# EAGLE design electricals_with_iPod_v2.6 (EAGLE 7.1.0)
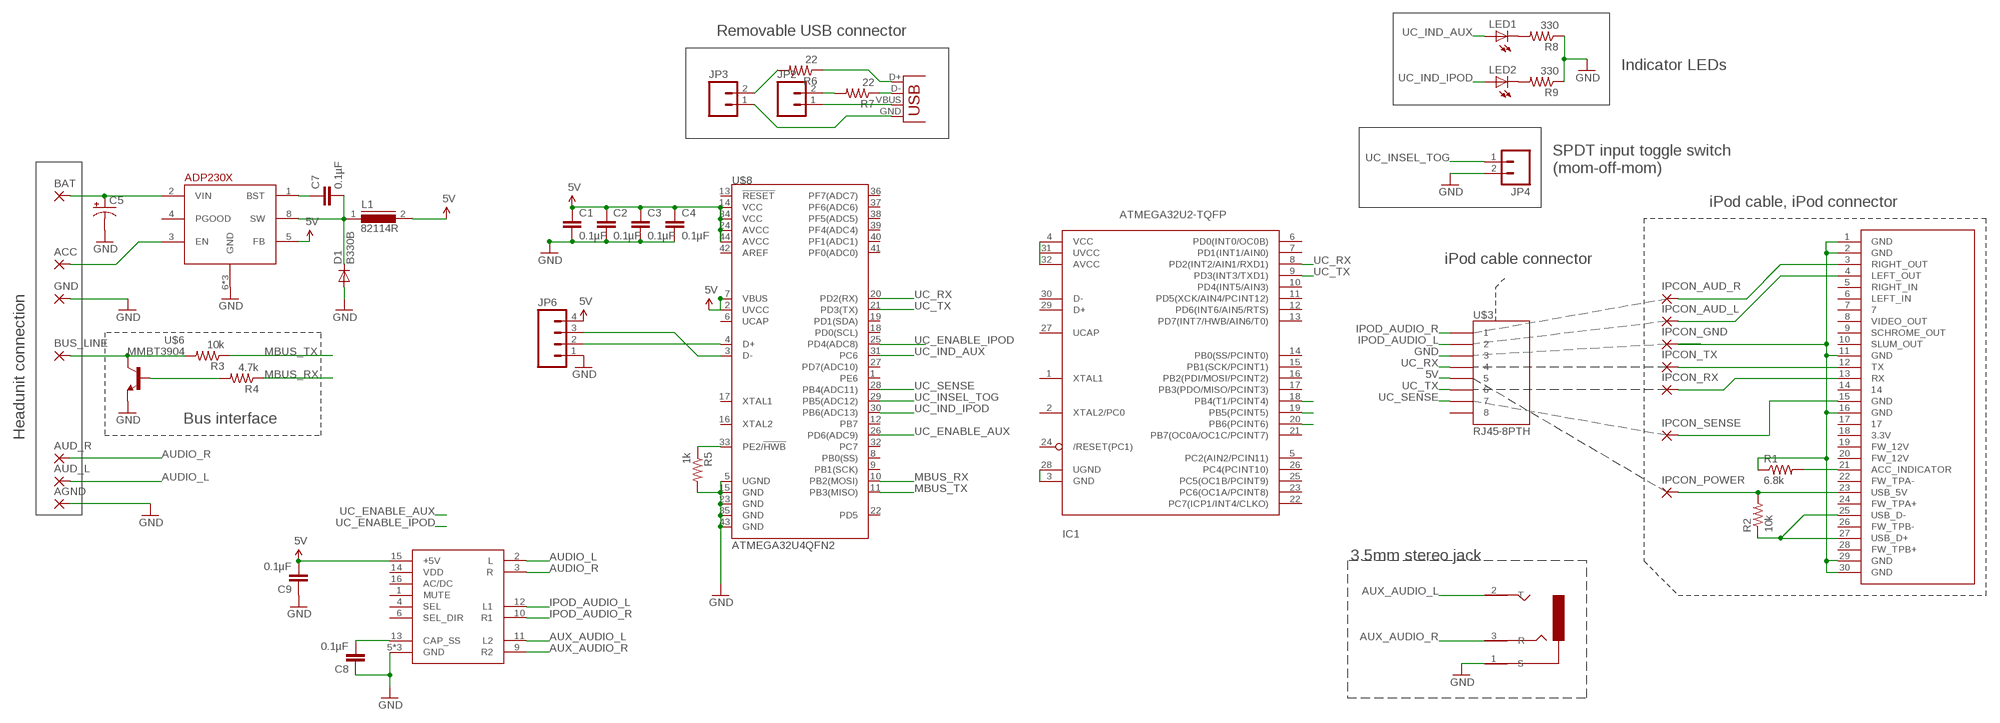
[diagram p0: schematic, sheet 1]

## Parts
ACC  1,6/0,9  [1,6/0,9]
AGND  1,6/0,9  [1,6/0,9]
AUD_L  1,6/0,9  [1,6/0,9]
AUD_R  1,6/0,9  [1,6/0,9]
BAT  2,54/1,1  [2,54/1,1]
BUS_LINE  1,6/0,9  [1,6/0,9]
C1  0.1µF  CAP0603-CAP  [0603-CAP]
C2  0.1µF  CAP0603-CAP  [0603-CAP]
C3  0.1µF  CAP0603-CAP  [0603-CAP]
C4  0.1µF  CAP0603-CAP  [0603-CAP]
C5  CAP_POLPTH2  [CPOL-RADIAL-10UF-25V]
C7  0.1µF  CAP0603-CAP  [0603-CAP]
C8  0.1µF  CAP0603-CAP  [0603-CAP]
C9  0.1µF  CAP0603-CAP  [0603-CAP]
D1  B330B  DIODESMA-ALT  [SMA-DIODE_ALT]
GND  2,54/1,1  [2,54/1,1]
IC1  ATMEGA32U2-TQFP  [TQFP32-08]
IPCON_AUD_L  1,6/0,9  [1,6/0,9]
IPCON_AUD_R  1,6/0,9  [1,6/0,9]
IPCON_GND  1,6/0,9  [1,6/0,9]
IPCON_POWER  1,6/0,9  [1,6/0,9]
IPCON_RX  1,6/0,9  [1,6/0,9]
IPCON_SENSE  1,6/0,9  [1,6/0,9]
IPCON_TX  1,6/0,9  [1,6/0,9]
JP1  USBSMD  [USB-MINIB]
JP2  M02POGO_PIN_HOLES_ONLY  [1X02_PP_HOLES_ONLY]
JP3  M02POGO_PIN_HOLES_ONLY  [1X02_PP_HOLES_ONLY]
JP4  M02LOCK  [1X02_LOCK]
JP6  M04PTH  [1X04]
L1  82114R  [82114R]
LED1  LED0603  [LED-0603]
LED2  LED0603  [LED-0603]
R1  6.8k  RESISTOR0603-RES  [0603-RES]
R2  10k  RESISTOR0603-RES  [0603-RES]
R3  10k  RESISTOR0603-RES  [0603-RES]
R4  4.7k  RESISTOR0603-RES  [0603-RES]
R5  1k  RESISTOR0603-RES  [0603-RES]
R6  22  RESISTOR0603-RES  [0603-RES]
R7  22  RESISTOR0603-RES  [0603-RES]
R8  330  RESISTOR0603-RES  [0603-RES]
R9  330  RESISTOR0603-RES  [0603-RES]
U$1  IPOD_CONNECTOR_MALE  [IPOD_MALE_CONNECTOR]
U$3  RJ45-8PTH  [RJ45-8]
U$5  ADP230X  [SO8-THERM]
U$6  MMBT3904  [SOT23-3]
U$7  STEREO_JACK_SJ1-353XNG3NG  [3.5MM_SJ1-353XNG]
U$8  ATMEGA32U4QFN2  [SPARKFUN-DIGITALIC_QFN-44-NOPAD]
U$11  ISL54405IRTZ  [QFN-16]

## Nets
5V: C1.1 C2.1 C3.1 C4.1 C9.2 JP6.4 L1.2 U$3.5 U$5.5(FB) U$8.2(UVCC) U$8.7(VBUS) U$8.14(VCC) U$8.24(AVCC) U$8.34(VCC) U$8.44(AVCC) U$11.15(+5V)
AUDIO_L: AUD_L.1(P) U$11.2(L)
AUDIO_R: AUD_R.1(P) U$11.3(R)
AUX_AUDIO_L: U$7.2(T) U$11.11(L2)
AUX_AUDIO_R: U$7.3(R) U$11.9(R2)
GND: AGND.1(P) C1.2 C2.2 C3.2 C4.2 C5.2(-) C8.1 C9.1 D1.A GND.1(P) JP4.2 JP6.1 R5.2 R8.1 R9.1 U$3.3 U$5.6(GND) U$5.7(GND) U$5.PAD(GND) U$6.2(E) U$7.1(S) U$8.5(UGND) U$8.15(GND) U$8.23(GND) U$8.35(GND) U$8.43(GND) U$11.5(GND) U$11.7(GND) U$11.8(GND)
IP_GND: IPCON_GND.1(P) R1.1 U$1.1(GND) U$1.2(GND) U$1.11(GND) U$1.16(GND) U$1.29(GND) U$1.30(GND)
IPOD_AUDIO_L: U$3.2 U$11.12(L1)
IPOD_AUDIO_R: U$3.1 U$11.10(R1)
MBUS_RX: R4.1 U$8.10(PB2(MOSI))
MBUS_TX: R3.1 U$8.11(PB3(MISO))
N$1: ACC.1(P) U$5.3(EN)
N$2: BAT.1(P) C5.1(+) U$5.2(VIN)
N$3: C7.2 D1.C L1.1 U$5.8(SW)
N$4: IPCON_POWER.1(P) R2.2 U$1.23(USB_5V)
N$5: C7.1 U$5.1(BST)
N$6: IPCON_SENSE.1(P) U$1.15(GND)
N$7: IPCON_RX.1(P) U$1.13(RX)
N$8: IPCON_TX.1(P) U$1.12(TX)
N$9: IPCON_AUD_R.1(P) U$1.3(RIGHT_OUT)
N$10: IPCON_AUD_L.1(P) U$1.4(LEFT_OUT)
N$11: R2.1 U$1.25(USB_D-) U$1.27(USB_D+)
N$12: C8.2 U$11.13(CAP_SS)
N$13: R1.2 U$1.21(ACC_INDICATOR)
N$14: R5.1 U$8.33(PE2/!HWB)
N$15: LED1.C R8.2
N$16: LED2.C R9.2
N$17: IC1.3(GND) IC1.28(UGND)
N$18: IC1.4(VCC) IC1.32(AVCC)
N$19: BUS_LINE.1(P) R3.2 U$6.3(C)
N$20: R4.2 U$6.1(B)
N$21: JP1.D+ R6.1
N$22: JP1.D- R7.1
N$23: IC1.18(PB4(T1/PCINT4))
N$24: IC1.19(PB5(PCINT5))
N$25: IC1.20(PB6(PCINT6))
UC_ENABLE_AUX: U$8.26(PD6(ADC9))
UC_ENABLE_IPOD: U$8.25(PD4(ADC8))
UC_IND_AUX: LED1.A U$8.31(PC6)
UC_IND_IPOD: LED2.A U$8.30(PB6(ADC13))
UC_INSEL_TOG: JP4.1 U$8.29(PB5(ADC12))
UC_RX: IC1.8(PD2(INT2/AIN1/RXD1)) U$3.4 U$8.20(PD2(RX))
UC_SENSE: U$3.7 U$8.28(PB4(ADC11))
UC_TX: IC1.9(PD3(INT3/TXD1)) U$3.6 U$8.21(PD3(TX))
USB_BOB_D+: JP3.2 R6.2
USB_BOB_D-: JP2.2 R7.2
USB_BOB_GND: JP1.GND JP3.1
USB_BOB_VBUS: JP1.VBUS JP2.1
USB_D+: JP6.2 U$8.4(D+)
USB_D-: JP6.3 U$8.3(D-)
Unconnected: IC1.1(XTAL1) IC1.2(XTAL2/PC0) IC1.5(PC2(AIN2/PCIN11)) IC1.6(PD0(INT0/OC0B)) IC1.7(PD1(INT1/AIN0)) IC1.10(PD4(INT5/AIN3)) IC1.11(PD5(XCK/AIN4/PCINT12)) IC1.12(PD6(INT6/AIN5/RTS)) IC1.13(PD7(INT7/HWB/AIN6/T0)) IC1.14(PB0(SS/PCINT0)) IC1.15(PB1(SCK/PCINT1)) IC1.16(PB2(PDI/MOSI/PCINT2)) IC1.17(PB3(PDO/MISO/PCINT3)) IC1.21(PB7(OC0A/OC1C/PCINT7)) IC1.22(PC7(ICP1/INT4/CLKO)) IC1.23(PC6(OC1A/PCINT8)) IC1.24(/RESET(PC1)) IC1.25(PC5(OC1B/PCINT9)) IC1.26(PC4(PCINT10)) IC1.27(UCAP) IC1.29(D+) IC1.30(D-) IC1.31(UVCC) U$1.5(RIGHT_IN) U$1.6(LEFT_IN) U$1.7 U$1.8(VIDEO_OUT) U$1.9(SCHROME_OUT) U$1.10(SLUM_OUT) U$1.14 U$1.17 U$1.18(3.3V) U$1.19(FW_12V) U$1.20(FW_12V) U$1.22(FW_TPA-) U$1.24(FW_TPA+) U$1.26(FW_TPB-) U$1.28(FW_TPB+) U$3.8 U$5.4(PGOOD) U$8.1(PE6) U$8.6(UCAP) U$8.8(PB0(SS)) U$8.9(PB1(SCK)) U$8.12(PB7) U$8.13(!RESET) U$8.16(XTAL2) U$8.17(XTAL1) U$8.18(PD0(SCL)) U$8.19(PD1(SDA)) U$8.22(PD5) U$8.27(PD7(ADC10)) U$8.32(PC7) U$8.36(PF7(ADC7)) U$8.37(PF6(ADC6)) U$8.38(PF5(ADC5)) U$8.39(PF4(ADC4)) U$8.40(PF1(ADC1)) U$8.41(PF0(ADC0)) U$8.42(AREF) U$11.1(MUTE) U$11.4(SEL) U$11.6(SEL_DIR) U$11.14(VDD) U$11.16(AC/DC)

## Notes on the sheet
- Removable USB connector
- Indicator LEDs
- SPDT input toggle switch
  (mom-off-mom)
- iPod cable, iPod connector
- iPod cable connector
- Headunit connection
- Bus interface
- 3.5mm stereo jack

## Library data of the parts
ACC AGND AUD_L AUD_R BUS_LINE IPCON_AUD_L IPCON_AUD_R IPCON_GND IPCON_POWER IPCON_RX IPCON_SENSE IPCON_TX = wirepad:1,6/0,9: THROUGH-HOLE PAD
BAT GND = wirepad:2,54/1,1: THROUGH-HOLE PAD
C1-C4 C7-C9 = SparkFun-Passives:CAP: Capacitor Standard 0603 ceramic capacitor, and 0.1" leaded capacitor.
C5 = SparkFun-Capacitors:CAP_POL: Capacitor Polarized These are standard SMD and PTH capacitors. Normally 10uF, 47uF, and 100uF in electrolytic and tantalum varieties. Always verify the external diameter of the through hole cap, it varies with capacity, voltage, and manufacturer. The EIA devices should be standard.
D1 = SparkFun:DIODE: Diode These are standard reverse protection diodes and small signal diodes. SMA package can handle up to about 1A. SOD-323 can handle about 200mA. What the SOD-323 package when ordering, there are some mfgs out there that are 5-pin packages.
IC1 = adafruit:ATMEGA32U2: ATmega32u2 Pin compatible with the atmega8u2, atmega16u2 and atmega32u2 8, 16 or 32 K flash, 1K RAM, 512b EEPROM 8 bit and 16 bit timer (5 PWM total) UART, SPI (no I2C!) USB with 4 endpoints, LUFA compatible 22 I/O lines, analog comparator (no ADC!) Comes with DFU bootloader burned in!
JP1 = SparkFun-Connectors:USB: USB Connectors USB-B-PTH is fully proven SKU : PRT-00139/CONN-08278 USB-miniB is fully proven SKU : PRT-00587 USB-A-PCB is untested. USB-A-H is throughly reviewed, but untested. Spark Fun Electronics SKU : PRT-00437 USB-B-SMT is throughly reviewed, but untested. Needs silkscreen touching up. USB-A-S has not been used/tested USB-MB-H has not been used/tested USB-MICROB has been used. CONN-09505
JP2-JP4 = SparkFun-Connectors:M02: Header 2 Standard 2-pin 0.1" header. Use with straight break away headers (SKU : PRT-00116), right angle break away headers (PRT-00553), swiss pins (PRT-00743), machine pins (PRT-00117), and female headers (PRT-00115). Molex polarized connector foot print use with SKU : PRT-08233 with associated crimp pins and housings.
JP6 = SparkFun-Connectors:M04: Header 4 Standard 4-pin 0.1" header. Use with straight break away headers (SKU : PRT-00116), right angle break away headers (PRT-00553), swiss pins (PRT-00743), machine pins (PRT-00117), and female headers (PRT-00115). Molex polarized connector foot print use with SKU : PRT-08231 with associated crimp pins and housings. 1MM SMD Version SKU: PRT-10208
L1 = inductors:82114R: INDUCTOR
LED1 LED2 = SparkFun-LED:LED: LEDs Standard schematic elements and footprints for 5mm, 3mm, 1206, and 0603 sized LEDs. 5mm - Spark Fun Electronics SKU : COM-00529 (and others)
R1-R9 = SparkFun-Resistors:RESISTOR: Resistor Basic schematic elements and footprints for 0603, 1206, and PTH resistors.
U$1 = SparkFun:IPOD_CONNECTOR_MALE: iPod Male Connector This is the connector that will insert into an iPods. Use this connector to gain access to the various iPod pins. Schematic and footprint are not yet production proven. The PCB thickness must be more thin than the standard 0.062" FR4. Spark Fun Electronics SKU : DEV-00633
U$3 = SparkFun-Connectors:RJ45-8: RJ45 Jack Simple RJ45, 8-pin connection - connector for common Cat5, Cat5e, and Cat6 Ethernet cables. Footprint not yet proven in production. Connector sku is PRT-00643; Breakout PCB sku is BOB-00716.
U$5 = personal:ADP230X
U$6 = personal:MMBT3904
U$7 = personal:STEREO_JACK
U$8 = SparkFun-DigitalIC:ATMEGA32U4: Atmel 44-pin 8-bit Microcontroller with 32KBytes of ISP Flash and USB Controller
U$11 = personal:ISL54405

## Board
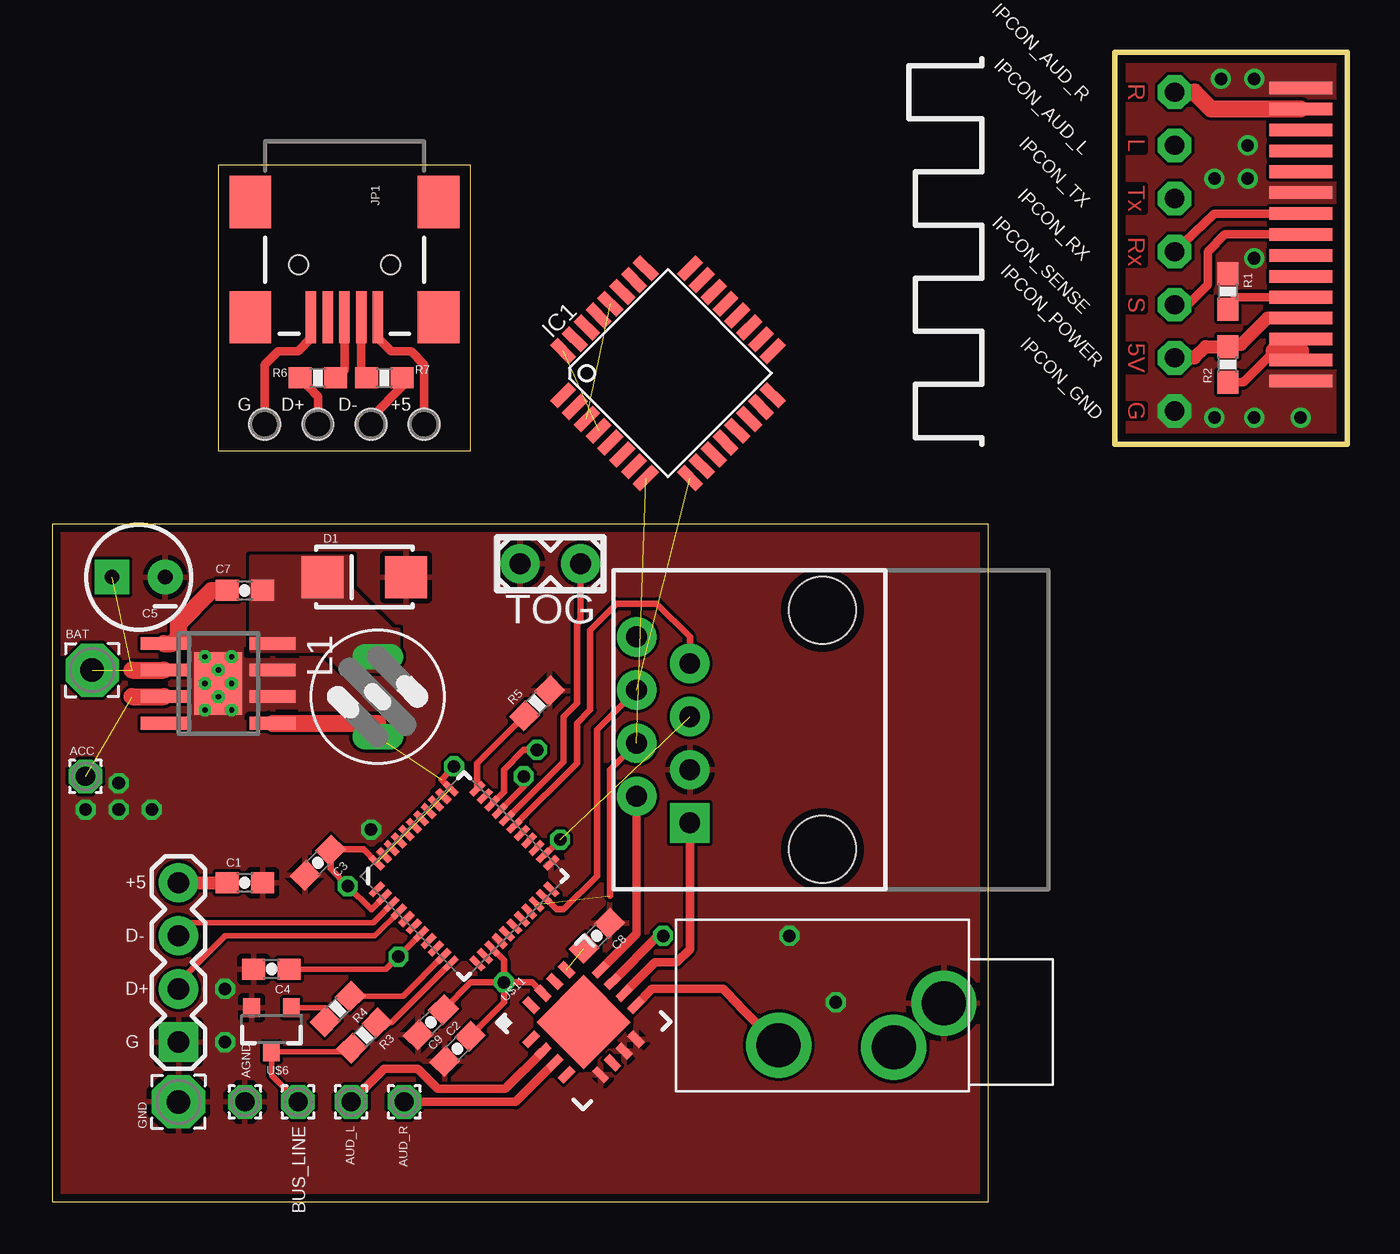
[diagram p1: board, top side]
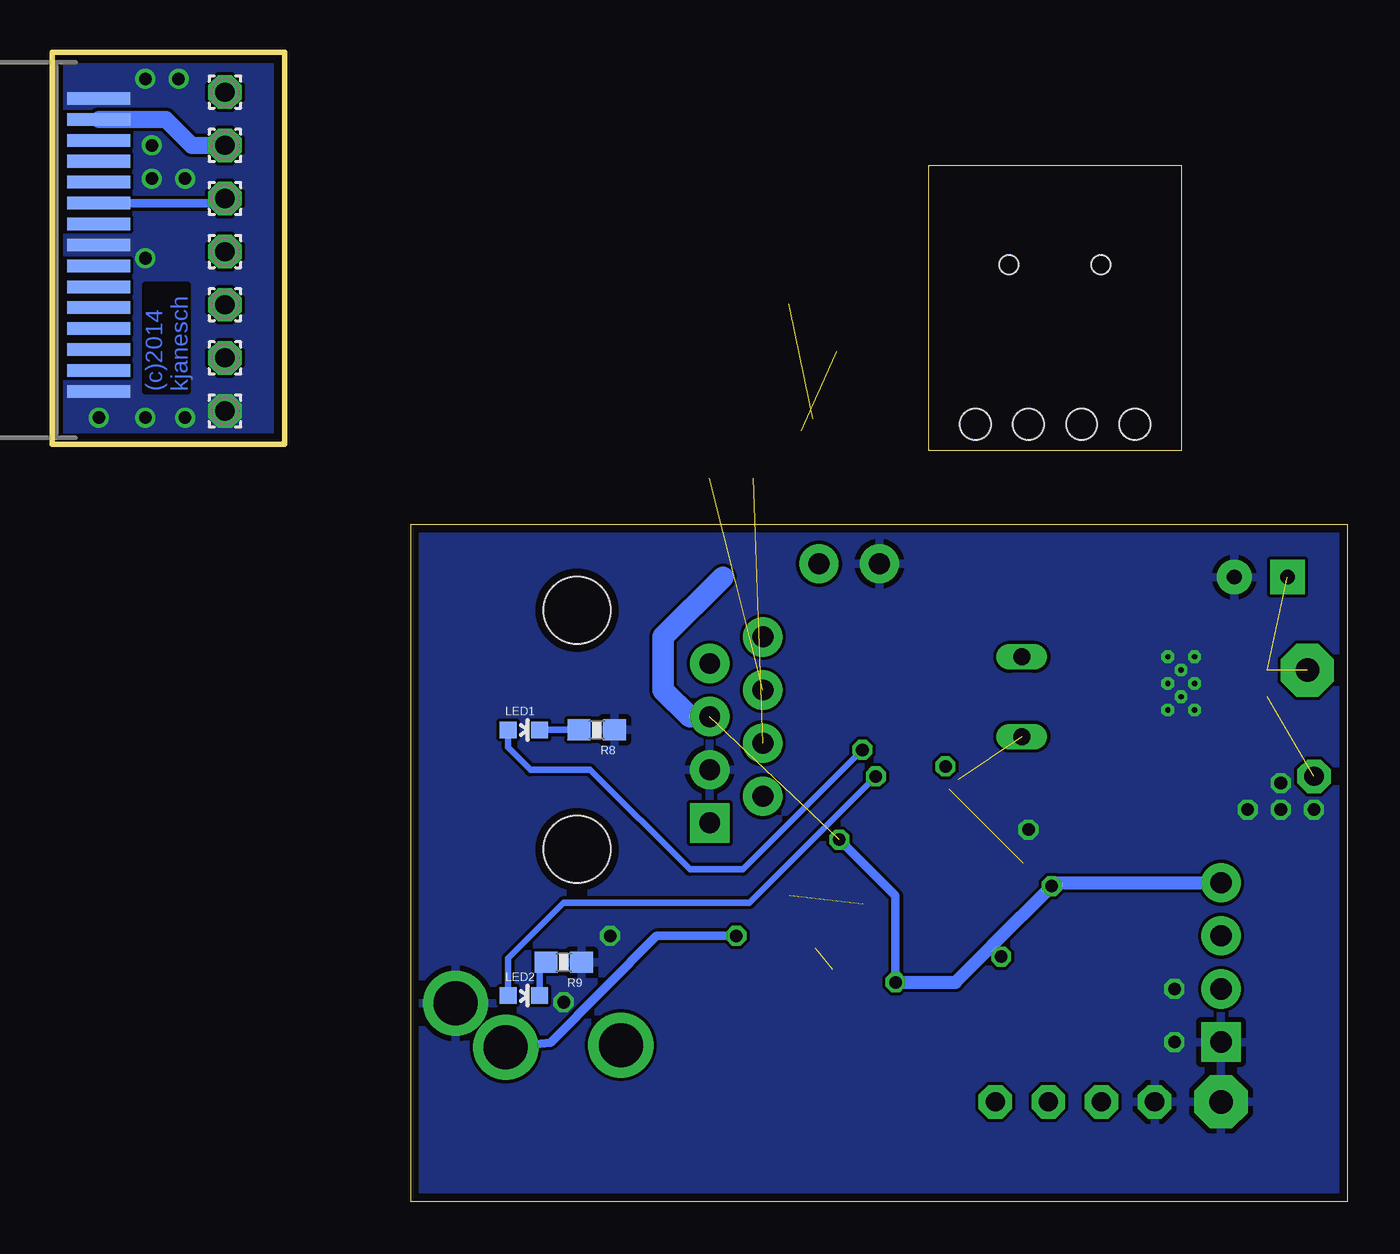
[diagram p2: board, bottom side, seen from below]

Size 61.91 x 54.93 mm. Coordinates in mm from the lower left corner, seen from the top.
Outline: 0,0 44.76,0 44.76,32.38 0,32.38 0,0
Outline: 61.91,54.93 50.8,54.93 50.8,36.2 61.91,36.2 61.91,54.93
Outline: 7.94,49.53 7.94,35.88 20,35.88 20,49.53 7.94,49.53
Copper layers (1*16): Top 0.0356mm / dielectric 1.5011mm / Bottom 0.0356mm
Design rules "LaenPCBOrder": minimum track width 6mil, minimum drill 13mil, track to track 6mil, track to pad 6mil, pad to pad 6mil, via to via 6mil, smd to smd 6mil, copper to edge 15mil, drill to drill 6mil, minimum pad ring 7mil, minimum via ring 7mil, stop-mask expansion 3mil, vias tented up to drill 0mil, thermal gap 10mil

### Footprints (pad centres in the part's own frame; a part is rotated, then mirrored left to right if it is on the bottom)
1,6/0,9 = drill 0.914 pad 1.6 octagon: 1 0,0
2,54/1,1 = drill 1.118 pad 2.54 octagon: 1 0,0
0603-CAP = smd 1.1 x 1: 1 -0.85,0; 2 0.85,0
CPOL-RADIAL-10UF-25V = drill 0.7 pad 1.651 square: 1 1.27,0 | drill 0.7 pad 1.651: 2 -1.27,0
SMA-DIODE_ALT = smd 2 x 2: A -2,0; C 2,0
TQFP32-08 = smd 1.27 x 0.508: 1 -4.293,2.8; 2 -4.293,2; 3 -4.293,1.2; 4 -4.293,0.4; 5 -4.293,-0.4; 6 -4.293,-1.2; 7 -4.293,-2; 8 -4.293,-2.8; 17 4.293,-2.8; 18 4.293,-2; 19 4.293,-1.2; 20 4.293,-0.4; 21 4.293,0.4; 22 4.293,1.2; 23 4.293,2; 24 4.293,2.8 | smd 0.508 x 1.27: 9 -2.8,-4.293; 10 -2,-4.293; 11 -1.2,-4.293; 12 -0.4,-4.293; 13 0.4,-4.293; 14 1.2,-4.293; 15 2,-4.293; 16 2.8,-4.293; 25 2.8,4.293; 26 2,4.293; 27 1.2,4.293; 28 0.4,4.293; 29 -0.4,4.293; 30 -1.2,4.293; 31 -2,4.293; 32 -2.8,4.293
USB-MINIB = smd 2.5 x 0.5: D+ 2.5,0; D- 2.5,0.8; GND 2.5,-1.6; ID 2.5,-0.8; VBUS 2.5,1.6 | smd 2.5 x 2: MTN1 -3,4.5; MTN2 2.5,4.5; MTN3 -3,-4.5; MTN4 2.5,-4.5 | hole 0.9: 0,2.2; 0,-2.2
1X02_PP_HOLES_ONLY = drill 0.889 pad 0.813: 1 0,0; 2 2.54,0 | hole 1.473: 0,0; 2.54,0
1X02_LOCK = drill 1.016 pad 1.88: 1 -0.178,0; 2 2.718,0
1X04 = drill 1.016 pad 1.88 square: 1 0,0 | drill 1.016 pad 1.88: 2 2.54,0; 3 5.08,0; 4 7.62,0
82114R = drill 0.813 long: 1 0,1.905; 2 0,-1.905
LED-0603 = smd 0.8 x 0.8: A 0,-0.75; C 0,0.75
0603-RES = smd 1.1 x 1: 1 -0.85,0; 2 0.85,0
IPOD_MALE_CONNECTOR = smd 0.6 x 3 bottom: 1 7.5,0; 3 6.5,0; 5 5.5,0; 7 4.5,0; 9 3.5,0; 11 2.5,0; 13 1.5,0; 15 0.5,0; 17 -0.5,0; 19 -1.5,0; 21 -2.5,0; 23 -3.5,0; 25 -4.5,0; 27 -5.5,0; 29 -6.5,0 | smd 0.6 x 3: 2 7,0; 4 6,0; 6 5,0; 8 4,0; 10 3,0; 12 2,0; 14 1,0; 16 0,0; 18 -1,0; 20 -2,0; 22 -3,0; 24 -4,0; 26 -5,0; 28 -6,0; 30 -7,0
RJ45-8 = drill 1 pad 1.88 square: 1 -4.445,6.35 | drill 1 pad 1.88: 2 -3.175,8.89; 3 -1.905,6.35; 4 -0.635,8.89; 5 0.635,6.35; 6 1.905,8.89; 7 3.175,6.35; 8 4.445,8.89 | hole 3.2: -5.715,0; 5.715,0
SO8-THERM = smd 0.6 x 2.2: 1 -1.905,-2.6; 2 -0.635,-2.6; 3 0.635,-2.6; 4 1.905,-2.6; 5 1.905,2.6; 6 0.635,2.6; 7 -0.635,2.6; 8 -1.905,2.6 | smd 3 x 2.3: PAD 0,0
SOT23-3 = smd 0.8 x 0.9: 1 -0.95,-1; 2 0.95,-1; 3 0,1.1
3.5MM_SJ1-353XNG = drill 2.1 pad 2.54: 1 -5.8,-0.9; 2 -3.4,1.2; 3 2.1,1.1
SPARKFUN-DIGITALIC_QFN-44-NOPAD = smd 0.8 x 0.3: 1 -3.4,2.5; 2 -3.4,2; 3 -3.4,1.5; 4 -3.4,1; 5 -3.4,0.5; 6 -3.4,0; 7 -3.4,-0.5; 8 -3.4,-1; 9 -3.4,-1.5; 10 -3.4,-2; 11 -3.4,-2.5; 23 3.4,-2.5; 24 3.4,-2; 25 3.4,-1.5; 26 3.4,-1; 27 3.4,-0.5; 28 3.4,0; 29 3.4,0.5; 30 3.4,1; 31 3.4,1.5; 32 3.4,2; 33 3.4,2.5 | smd 0.3 x 0.8: 12 -2.5,-3.4; 13 -2,-3.4; 14 -1.5,-3.4; 15 -1,-3.4; 16 -0.5,-3.4; 17 0,-3.4; 18 0.5,-3.4; 19 1,-3.4; 20 1.5,-3.4; 21 2,-3.4; 22 2.5,-3.4; 34 2.5,3.4; 35 2,3.4; 36 1.5,3.4; 37 1,3.4; 38 0.5,3.4; 39 0,3.4; 40 -0.5,3.4; 41 -1,3.4; 42 -1.5,3.4; 43 -2,3.4; 44 -2.5,3.4
QFN-16 = smd 0.8 x 0.4: 1 -2.35,1.2; 2 -2.35,0.4; 3 -2.35,-0.4; 4 -2.35,-1.2; 9 2.35,-1.2; 10 2.35,-0.4; 11 2.35,0.4; 12 2.35,1.2 | smd 0.35 x 0.8: 5 -1.2,-2.35 | smd 0.4 x 0.8: 6 -0.4,-2.35; 7 0.4,-2.35; 8 1.2,-2.35; 13 1.2,2.35; 14 0.4,2.35; 15 -0.4,2.35; 16 -1.2,2.35 | smd 3.19 x 3.19: EXP 0,0

### Placement (x,y rotation side)
ACC  1.59,20.32 0 top
AGND  9.21,4.76 180 top
AUD_L  14.29,4.76 0 top
AUD_R  16.83,4.76 0 top
BAT  1.91,25.4 0 top
BUS_LINE  11.75,4.76 90 top
C1  9.21,15.24 0 top
C2  18.1,8.57 225 top
C3  12.7,16.19 225 top
C4  10.48,11.11 180 top
C5  4.13,29.84 180 top
C7  9.21,29.21 0 top
C8  26.04,12.7 225 top
C9  19.37,7.3 45 top
D1  14.92,29.84 180 top
GND  6.03,4.76 90 top
IC1  29.43,39.59 45 top
IPCON_AUD_L  53.66,50.48 0 bottom
IPCON_AUD_R  53.66,53.02 0 bottom
IPCON_GND  53.66,37.78 0 bottom
IPCON_POWER  53.66,40.32 0 bottom
IPCON_RX  53.66,45.4 0 bottom
IPCON_SENSE  53.66,42.86 0 bottom
IPCON_TX  53.66,47.94 0 bottom
JP1  13.97,44.77 270 top
JP2  17.78,37.15 180 top
JP3  10.16,37.15 0 top
JP4  25.08,30.48 180 top
JP6  6.03,7.62 90 top
L1  15.56,24.13 0 top
LED1  39.37,22.54 270 bottom
LED2  39.37,9.84 270 bottom
R1  56.2,43.5 270 top
R2  56.2,40 90 top
R3  14.92,7.94 225 top
R4  13.65,9.21 225 top
R5  23.18,23.81 45 top
R6  12.7,39.37 180 top
R7  15.88,39.37 0 top
R8  35.88,22.54 180 bottom
R9  37.47,11.43 180 bottom
U$1  59.69,45.72 90 bottom
U$3  36.83,22.54 90 top
U$5  7.94,24.77 270 top
U$6  10.48,8.26 180 top
U$7  36.83,8.57 180 top
U$8  19.68,15.56 45 top
U$11  25.4,8.57 45 top

### Tracks (layer width: path | path; a pad name or v marks a point on that pad's centre or on a via)
5V  (via drill 0.6)  (3 unrouted)
  Top 0.254: C4.1 15.95,11.11 v16.55,11.71 U$8.7
  Top 0.305: U$8.14 21.59,11.53 v21.59,10.48 | U$11.15 22.93,10.48 v21.59,10.48 | C9.2 21.59,9.53 v21.59,10.48 | C2.1 20,10.48 v21.59,10.48 | U$8.44 14.88,16.83 13.34,16.83 C3.1 13.3,15.91 v14.13,15.08 15.24,13.97 15.27,13.97 U$8.2 | U$8.24 23.53,16.55 v24.29,17.3 | U$8.34 18.62,20.16 v19.21,20.8
  Top 0.61: JP6.4 C1.1 8.15,15.24
  Top 0.813: U$5.5 15.56,22.86 L1.2
  Bottom 0.406: v24.29,17.3 21.59,14.61 v21.59,10.48 | 31.43,23.18 U$3.5
  Bottom 0.61: v21.59,10.48 18.73,10.48 16.99,12.22 | 16.99,12.22 v14.13,15.08 13.97,15.24 JP6.4 | v16.55,11.71 16.99,12.15 16.99,12.22
  Bottom 1.016: 31.43,23.18 32.7,24.45 32.7,26.99 29.84,29.84
AUDIO_L
  Top 0.406: AUD_L.1 15.88,6.35 17.46,6.35 18.41,5.4 21.66,5.4 U$11.2
AUDIO_R
  Top 0.406: AUD_R.1 22.16,4.76 U$11.3
AUX_AUDIO_L  (via drill 0.6)
  Top 0.406: U$11.11 28.96,12.7 v29.21,12.7
  Bottom 0.406: v29.21,12.7 33.02,12.7 38.1,7.6 U$7.2
AUX_AUDIO_R
  Top 0.406: U$7.3 32.87,9.34 32.87,9.36 32.07,10.16 28.68,10.16 U$11.9
GND  (via drill 0.25 pad 0.41, 0.6)
  other vias: 4.76,18.73 3.17,18.73 8.26,10.16 15.24,17.78 1.59,18.73 3.17,20 7.3,26.04 7.94,25.4 8.57,26.04 8.57,24.77 7.94,24.13 8.57,23.49 7.3,23.49 7.3,24.77 8.26,7.62 35.24,12.7 37.47,9.53
  pour Bottom: 0,32.38 44.77,32.38 44.77,0 0,0
  pour Top (rank 2): 0,32.38 0,0 44.77,0 44.77,32.38
  pour Top (isolate 0.254, rank 2, no thermals): 5.08,27.94 5.08,21.27 13.65,21.27 13.65,27.94
IP_GND  (via drill 0.6)
  other vias: 57.15,48.89 57.47,53.66 59.69,37.46 57.47,37.46 57.47,45.09 55.56,37.46 55.56,48.89 55.88,53.66 57.15,50.48
  pour Top (no thermals): 50.8,54.93 50.8,36.2 61.91,36.2 61.91,54.93
  pour Bottom (no thermals): 50.8,54.93 50.8,36.2 61.91,36.2 61.91,54.93
IPOD_AUDIO_L
  Top 0.406: U$3.2 27.94,12.81 U$11.12
IPOD_AUDIO_R
  Top 0.406: U$3.1 30.48,12.07 29.84,11.43 28.82,11.43 U$11.10
MBUS_RX
  Top 0.254: R4.1 16.76,9.81 U$8.10
MBUS_TX
  Top 0.254: R3.1 16.2,8.54 U$8.11
N$1  (1 unrouted)
  Top 0.813: 3.81,24.13 U$5.3
N$2  (2 unrouted)
  Top 0.813: 3.81,25.4 U$5.2
N$3
  pour Top (isolate 0.254, no thermals): 14.29,30.8 14.29,29.21 16.19,27.3 16.51,27.3 16.51,25.4 13.97,25.4 13.02,26.35 9.53,26.35 9.53,30.8
N$4
  Top 0.61: U$1.23 58.09,42.22 56.83,40.96 56.3,40.96 R2.2 55.14,40.85 54.61,40.32 IPCON_POWER.1
N$5
  Top 0.813: U$5.1 5.71,26.67 6.03,26.99 6.03,27.62 7.62,29.21 C7.1
N$6
  Top 0.406: U$1.15 56.06,46.22 55.24,45.4 55.24,43.81 54.29,42.86 IPCON_SENSE.1
N$7
  Top 0.406: U$1.13 55.56,47.22 IPCON_RX.1
N$8
  Bottom 0.406: U$1.12 53.75,47.72 IPCON_TX.1
N$9
  Top 0.813: IPCON_AUD_R.1 54.61,53.02 55.4,52.22 U$1.3
N$10
  Bottom 0.813: U$1.4 56.48,51.72 55.24,50.48 IPCON_AUD_L.1
N$11
  Top 0.406: R2.1 56.94,39.16 58.42,40.64
  Top 0.61: U$1.25 59.69,40.64 U$1.27
  Top 0.813: 58.42,40.64 59.69,40.64
N$12  (1 unrouted)
N$13
  Top 0.406: U$1.21 56.6,43.22 R1.2
N$14
  Top 0.305: U$8.33 20.32,20.96 R5.1
N$15
  Bottom 0.305: LED1.C R8.2
N$16
  Bottom 0.305: R9.2 38.62,11.12 LED2.C
N$17  (1 unrouted)
N$18  (1 unrouted)
N$19
  Top 0.254: R3.2 14.14,7.16 U$6.3 10.48,6.03 BUS_LINE.1
N$20
  Top 0.254: U$6.1 13.04,9.26 R4.2
N$21
  Top 0.406: R6.1 13.97,39.74 JP1.D+
N$22
  Top 0.406: JP1.D- 14.77,39.57 R7.1
UC_IND_AUX  (via drill 0.6)
  Top 0.305: v23.18,21.59 22.54,21.59 21.59,20.64 21.59,19.58 U$8.31
  Bottom 0.305: v23.18,21.59 28.89,15.88 31.43,15.88 36.2,20.64 39.05,20.64 40.12,21.7 LED1.A
UC_IND_IPOD  (via drill 0.6)
  Top 0.305: v22.54,20.32 22.54,19.83 U$8.30
  Bottom 0.305: v22.54,20.32 28.57,14.29 37.47,14.29 40.12,11.63 LED2.A
UC_INSEL_TOG
  Top 0.305: U$8.29 24.45,21.03 24.45,23.18 25.08,23.81 25.08,27.62 25.26,27.8 JP4.1
UC_RX  (2 unrouted)
  Top 0.305: U$3.4 26.67,20.64 26.67,14.61
UC_SENSE
  Top 0.305: U$3.7 30.48,26.99 28.89,28.57 26.99,28.57 25.72,27.3 25.72,23.49 25.08,22.86 25.08,20.95 U$8.28
UC_TX  (1 unrouted)
  Top 0.305: U$3.6 26.04,22.54 26.04,15.56 24.45,13.97 24.1,13.97 U$8.21
USB_BOB_D+
  Top 0.406: R6.2 12.7,38.47 JP3.2
USB_BOB_D-
  Top 0.406: R7.2 16.83,39.32 16.83,39.05 15.24,37.46 JP2.2
USB_BOB_GND
  Top 0.406: JP1.GND 12.38,42.25 12.38,41.27 11.75,40.64 10.79,40.64 10.16,40 JP3.1
USB_BOB_VBUS
  Top 0.406: JP1.VBUS 15.56,42.25 15.56,41.27 16.19,40.64 17.14,40.64 17.78,40 JP2.1
USB_D+
  Top 0.254: JP6.2 6.03,10.48 8.26,12.7 15.41,12.7 U$8.4
USB_D-
  Top 0.254: JP6.3 6.67,13.34 15.34,13.34 U$8.3

### Text on the board
Top: R | L | Tx | Rx | S | 5V | G
Bottom: (c)2014 / kjanesch
tPlace: TOG
tNames: G | D+ | D- | +5 | +5 | D- | D+ | G